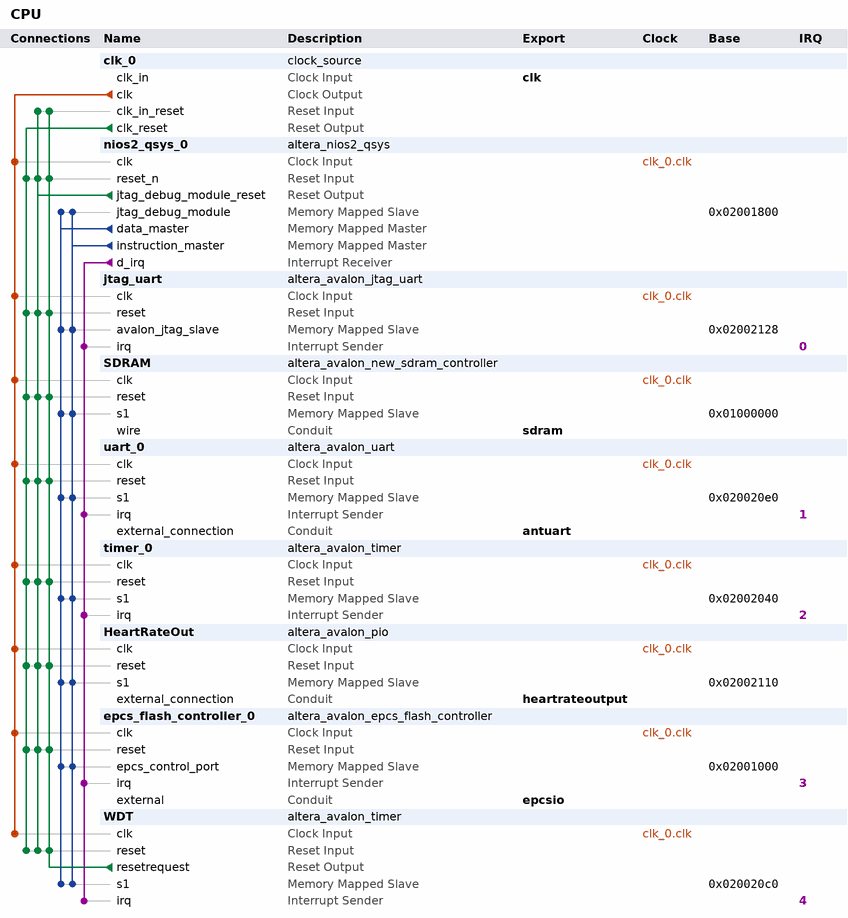
[diagram p0: system contents]
# Platform Designer (Qsys) system CPU, Cyclone IV E EP4CE22F17C6
# Parameters at their usual value, and those the tool derives, are not listed.
package require -exact qsys 13.1
create_system CPU
set_project_property DEVICE_FAMILY {Cyclone IV E}
set_project_property DEVICE EP4CE22F17C6

add_instance clk_0 clock_source 13.1
set_instance_parameter_value clk_0 clockFrequency 50000000

add_instance nios2_qsys_0 altera_nios2_qsys 13.1
set_instance_parameter_value nios2_qsys_0 muldiv_divider true
set_instance_parameter_value nios2_qsys_0 resetSlave epcs_flash_controller_0.epcs_control_port
set_instance_parameter_value nios2_qsys_0 mmu_TLBMissExcSlave nios2_qsys_0.jtag_debug_module
set_instance_parameter_value nios2_qsys_0 exceptionSlave SDRAM.s1
set_instance_parameter_value nios2_qsys_0 breakSlave nios2_qsys_0.jtag_debug_module
set_instance_parameter_value nios2_qsys_0 impl Tiny
set_instance_parameter_value nios2_qsys_0 icache_size 4096

add_instance jtag_uart altera_avalon_jtag_uart 13.1
set_instance_parameter_value jtag_uart simInteractiveOptions NO_INTERACTIVE_WINDOWS

add_instance SDRAM altera_avalon_new_sdram_controller 13.1
set_instance_parameter_value SDRAM TAC 6.5
set_instance_parameter_value SDRAM TRCD 20.0
set_instance_parameter_value SDRAM TRP 20.0
set_instance_parameter_value SDRAM casLatency 2
set_instance_parameter_value SDRAM columnWidth 9
set_instance_parameter_value SDRAM dataWidth 8
set_instance_parameter_value SDRAM generateSimulationModel false
set_instance_parameter_value SDRAM initRefreshCommands 8
set_instance_parameter_value SDRAM model single_Micron_MT48LC4M32B2_7_chip
set_instance_parameter_value SDRAM numberOfBanks 4
set_instance_parameter_value SDRAM numberOfChipSelects 1
set_instance_parameter_value SDRAM powerUpDelay 200.0
set_instance_parameter_value SDRAM refreshPeriod 0.75
set_instance_parameter_value SDRAM rowWidth 13

add_instance uart_0 altera_avalon_uart 13.1
set_instance_parameter_value uart_0 baud 4800
set_instance_parameter_value uart_0 dataBits 8
set_instance_parameter_value uart_0 fixedBaud true
set_instance_parameter_value uart_0 parity NONE
set_instance_parameter_value uart_0 stopBits 1

add_instance timer_0 altera_avalon_timer 13.1
set_instance_parameter_value timer_0 counterSize 64
set_instance_parameter_value timer_0 period 1
set_instance_parameter_value timer_0 periodUnits MSEC

add_instance HeartRateOut altera_avalon_pio 13.1
set_instance_parameter_value HeartRateOut direction Output
set_instance_parameter_value HeartRateOut width 8

add_instance epcs_flash_controller_0 altera_avalon_epcs_flash_controller 13.1

add_instance WDT altera_avalon_timer 13.1
set_instance_parameter_value WDT alwaysRun true
set_instance_parameter_value WDT fixedPeriod true
set_instance_parameter_value WDT period 10
set_instance_parameter_value WDT periodUnits SEC
set_instance_parameter_value WDT resetOutput true
set_instance_parameter_value WDT snapshot false

# connections
add_connection clk_0.clk epcs_flash_controller_0.clk clock
add_connection clk_0.clk HeartRateOut.clk clock
add_connection clk_0.clk jtag_uart.clk clock
add_connection clk_0.clk nios2_qsys_0.clk clock
add_connection clk_0.clk SDRAM.clk clock
add_connection clk_0.clk timer_0.clk clock
add_connection clk_0.clk uart_0.clk clock
add_connection clk_0.clk WDT.clk clock
add_connection clk_0.clk_reset epcs_flash_controller_0.reset reset
add_connection clk_0.clk_reset HeartRateOut.reset reset
add_connection clk_0.clk_reset jtag_uart.reset reset
add_connection clk_0.clk_reset nios2_qsys_0.reset_n reset
add_connection clk_0.clk_reset SDRAM.reset reset
add_connection clk_0.clk_reset timer_0.reset reset
add_connection clk_0.clk_reset uart_0.reset reset
add_connection clk_0.clk_reset WDT.reset reset
add_connection nios2_qsys_0.jtag_debug_module_reset clk_0.clk_in_reset reset
add_connection nios2_qsys_0.jtag_debug_module_reset epcs_flash_controller_0.reset reset
add_connection nios2_qsys_0.jtag_debug_module_reset HeartRateOut.reset reset
add_connection nios2_qsys_0.jtag_debug_module_reset jtag_uart.reset reset
add_connection nios2_qsys_0.jtag_debug_module_reset nios2_qsys_0.reset_n reset
add_connection nios2_qsys_0.jtag_debug_module_reset SDRAM.reset reset
add_connection nios2_qsys_0.jtag_debug_module_reset timer_0.reset reset
add_connection nios2_qsys_0.jtag_debug_module_reset uart_0.reset reset
add_connection nios2_qsys_0.jtag_debug_module_reset WDT.reset reset
add_connection WDT.resetrequest clk_0.clk_in_reset reset
add_connection WDT.resetrequest epcs_flash_controller_0.reset reset
add_connection WDT.resetrequest HeartRateOut.reset reset
add_connection WDT.resetrequest jtag_uart.reset reset
add_connection WDT.resetrequest nios2_qsys_0.reset_n reset
add_connection WDT.resetrequest SDRAM.reset reset
add_connection WDT.resetrequest timer_0.reset reset
add_connection WDT.resetrequest uart_0.reset reset
add_connection WDT.resetrequest WDT.reset reset
add_connection nios2_qsys_0.data_master epcs_flash_controller_0.epcs_control_port avalon
set_connection_parameter_value nios2_qsys_0.data_master/epcs_flash_controller_0.epcs_control_port baseAddress 0x02001000
add_connection nios2_qsys_0.data_master HeartRateOut.s1 avalon
set_connection_parameter_value nios2_qsys_0.data_master/HeartRateOut.s1 baseAddress 0x02002110
add_connection nios2_qsys_0.data_master jtag_uart.avalon_jtag_slave avalon
set_connection_parameter_value nios2_qsys_0.data_master/jtag_uart.avalon_jtag_slave baseAddress 0x02002128
add_connection nios2_qsys_0.data_master nios2_qsys_0.jtag_debug_module avalon
set_connection_parameter_value nios2_qsys_0.data_master/nios2_qsys_0.jtag_debug_module baseAddress 0x02001800
add_connection nios2_qsys_0.data_master SDRAM.s1 avalon
set_connection_parameter_value nios2_qsys_0.data_master/SDRAM.s1 baseAddress 0x01000000
add_connection nios2_qsys_0.data_master timer_0.s1 avalon
set_connection_parameter_value nios2_qsys_0.data_master/timer_0.s1 baseAddress 0x02002040
add_connection nios2_qsys_0.data_master uart_0.s1 avalon
set_connection_parameter_value nios2_qsys_0.data_master/uart_0.s1 baseAddress 0x020020e0
add_connection nios2_qsys_0.data_master WDT.s1 avalon
set_connection_parameter_value nios2_qsys_0.data_master/WDT.s1 baseAddress 0x020020c0
add_connection nios2_qsys_0.instruction_master epcs_flash_controller_0.epcs_control_port avalon
set_connection_parameter_value nios2_qsys_0.instruction_master/epcs_flash_controller_0.epcs_control_port baseAddress 0x02001000
add_connection nios2_qsys_0.instruction_master HeartRateOut.s1 avalon
set_connection_parameter_value nios2_qsys_0.instruction_master/HeartRateOut.s1 baseAddress 0x02002110
add_connection nios2_qsys_0.instruction_master jtag_uart.avalon_jtag_slave avalon
set_connection_parameter_value nios2_qsys_0.instruction_master/jtag_uart.avalon_jtag_slave baseAddress 0x02002128
add_connection nios2_qsys_0.instruction_master nios2_qsys_0.jtag_debug_module avalon
set_connection_parameter_value nios2_qsys_0.instruction_master/nios2_qsys_0.jtag_debug_module baseAddress 0x02001800
add_connection nios2_qsys_0.instruction_master SDRAM.s1 avalon
set_connection_parameter_value nios2_qsys_0.instruction_master/SDRAM.s1 baseAddress 0x01000000
add_connection nios2_qsys_0.instruction_master timer_0.s1 avalon
set_connection_parameter_value nios2_qsys_0.instruction_master/timer_0.s1 baseAddress 0x02002040
add_connection nios2_qsys_0.instruction_master uart_0.s1 avalon
set_connection_parameter_value nios2_qsys_0.instruction_master/uart_0.s1 baseAddress 0x020020e0
add_connection nios2_qsys_0.instruction_master WDT.s1 avalon
set_connection_parameter_value nios2_qsys_0.instruction_master/WDT.s1 baseAddress 0x020020c0
add_connection nios2_qsys_0.d_irq epcs_flash_controller_0.irq interrupt
set_connection_parameter_value nios2_qsys_0.d_irq/epcs_flash_controller_0.irq irqNumber 3
add_connection nios2_qsys_0.d_irq jtag_uart.irq interrupt
set_connection_parameter_value nios2_qsys_0.d_irq/jtag_uart.irq irqNumber 0
add_connection nios2_qsys_0.d_irq timer_0.irq interrupt
set_connection_parameter_value nios2_qsys_0.d_irq/timer_0.irq irqNumber 2
add_connection nios2_qsys_0.d_irq uart_0.irq interrupt
set_connection_parameter_value nios2_qsys_0.d_irq/uart_0.irq irqNumber 1
add_connection nios2_qsys_0.d_irq WDT.irq interrupt
set_connection_parameter_value nios2_qsys_0.d_irq/WDT.irq irqNumber 4

# exported interfaces
add_interface clk clock sink
set_interface_property clk EXPORT_OF clk_0.clk_in
add_interface sdram conduit end
set_interface_property sdram EXPORT_OF SDRAM.wire
add_interface antuart conduit end
set_interface_property antuart EXPORT_OF uart_0.external_connection
add_interface heartrateoutput conduit end
set_interface_property heartrateoutput EXPORT_OF HeartRateOut.external_connection
add_interface epcsio conduit end
set_interface_property epcsio EXPORT_OF epcs_flash_controller_0.external

set_interconnect_requirement {$system} qsys_mm.clockCrossingAdapter HANDSHAKE
set_interconnect_requirement {$system} qsys_mm.maxAdditionalLatency 1
set_interconnect_requirement {$system} qsys_mm.insertDefaultSlave false

save_system CPU.qsys
